# Altium schematic sheet COOLING_FAN.SchDoc
size OrCAD B; SheetNumber: 9; SheetTotal: 12
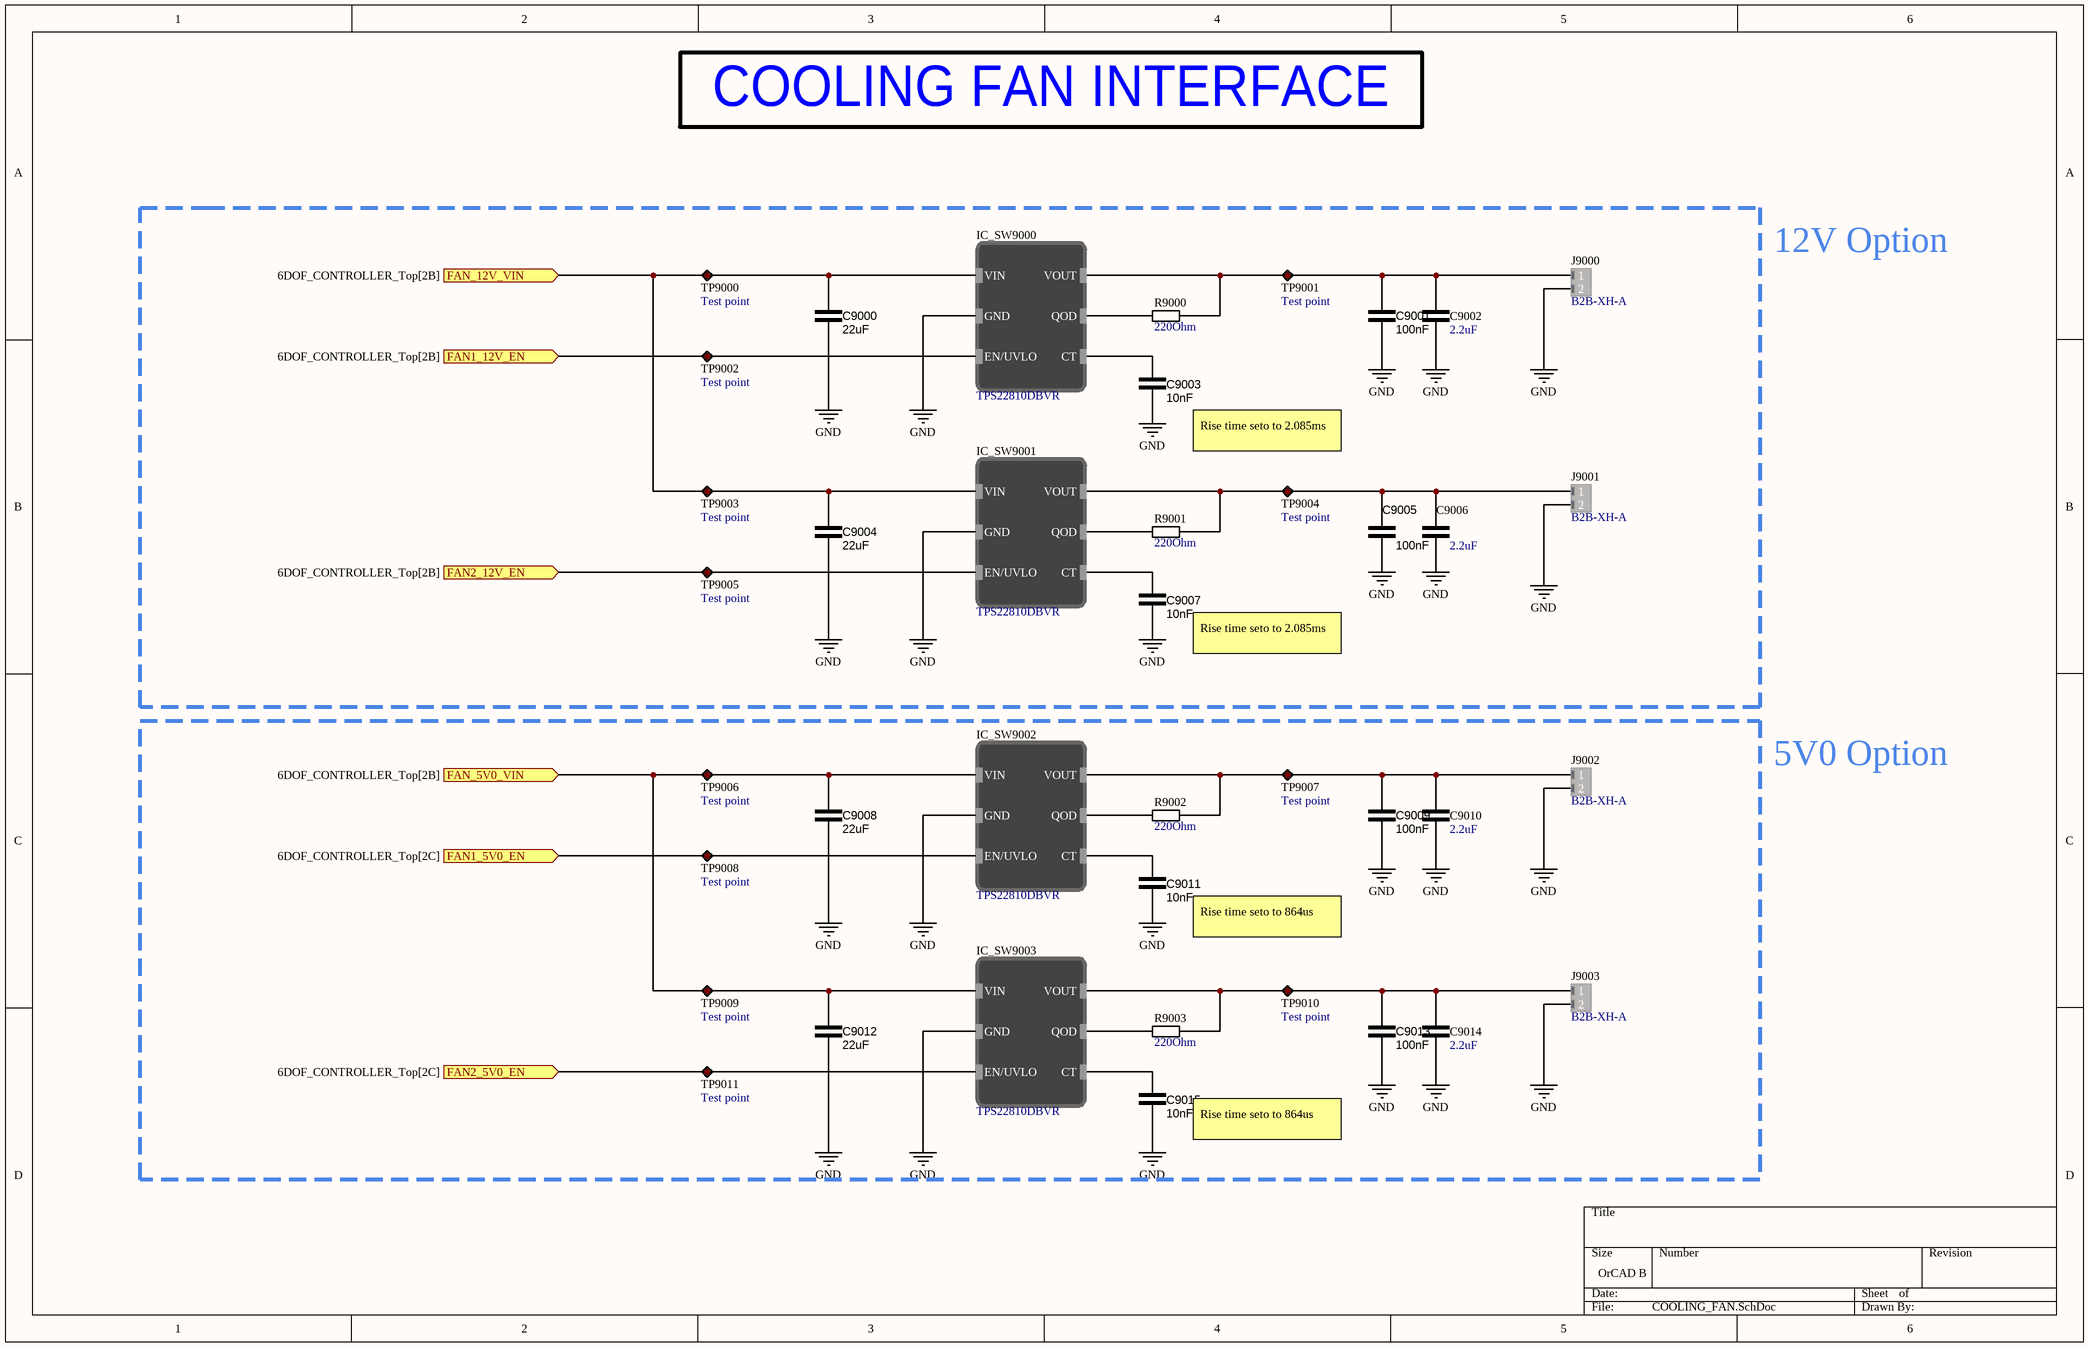
[diagram p0: COOLING_FAN.SchDoc]

## Parts
C9000  22uF  [CAP_0805]
C9001  100nF  [CAP_0603]
C9002  2.2uF  [CAP_0603]
C9003  10nF  [CAP_0603]
C9004  22uF  [CAP_0805]
C9005  100nF  [CAP_0603]
C9006  2.2uF  [CAP_0603]
C9007  10nF  [CAP_0603]
C9008  22uF  [CAP_0805]
C9009  100nF  [CAP_0603]
C9010  2.2uF  [CAP_0603]
C9011  10nF  [CAP_0603]
C9012  22uF  [CAP_0805]
C9013  100nF  [CAP_0603]
C9014  2.2uF  [CAP_0603]
C9015  10nF  [CAP_0603]
IC_SW9000  TPS22810DBVR  [SOT95P280X145-6N]
IC_SW9001  TPS22810DBVR  [SOT95P280X145-6N]
IC_SW9002  TPS22810DBVR  [SOT95P280X145-6N]
IC_SW9003  TPS22810DBVR  [SOT95P280X145-6N]
J9000  B2B-XH-A  [JST_XH_2POS]
J9001  B2B-XH-A  [JST_XH_2POS]
J9002  B2B-XH-A  [JST_XH_2POS]
J9003  B2B-XH-A  [JST_XH_2POS]
R9000  220Ohm  [RES_0603]
R9001  220Ohm  [RES_0603]
R9002  220Ohm  [RES_0603]
R9003  220Ohm  [RES_0603]
TP9000  Test point  [TestPoint]
TP9001  Test point  [TestPoint]
TP9002  Test point  [TestPoint]
TP9003  Test point  [TestPoint]
TP9004  Test point  [TestPoint]
TP9005  Test point  [TestPoint]
TP9006  Test point  [TestPoint]
TP9007  Test point  [TestPoint]
TP9008  Test point  [TestPoint]
TP9009  Test point  [TestPoint]
TP9010  Test point  [TestPoint]
TP9011  Test point  [TestPoint]

## Ports
FAN1_5V0_EN (in, see 6DOF_CONTROLLER_Top[2C]), FAN1_12V_EN (in, see 6DOF_CONTROLLER_Top[2B]), FAN2_5V0_EN (in, see 6DOF_CONTROLLER_Top[2C]), FAN2_12V_EN (in, see 6DOF_CONTROLLER_Top[2B]), FAN_5V0_VIN (in, see 6DOF_CONTROLLER_Top[2B]), FAN_12V_VIN (in, see 6DOF_CONTROLLER_Top[2B])

## Nets
GND: C9000.1 C9001.2 C9002.1 C9003.1 C9004.1 C9005.2 C9006.1 C9007.1 C9008.1 C9009.2 C9010.1 C9011.1 C9012.1 C9013.2 C9014.1 C9015.1 IC_SW9000.2(GND) IC_SW9001.2(GND) IC_SW9002.2(GND) IC_SW9003.2(GND) J9000.2 J9001.2 J9002.2 J9003.2
FAN1_5V0_EN: IC_SW9002.3(EN/UVLO) TP9008.1 ; port FAN1_5V0_EN
FAN1_12V_EN: IC_SW9000.3(EN/UVLO) TP9002.1 ; port FAN1_12V_EN
FAN2_5V0_EN: IC_SW9003.3(EN/UVLO) TP9011.1 ; port FAN2_5V0_EN
FAN2_12V_EN: IC_SW9001.3(EN/UVLO) TP9005.1 ; port FAN2_12V_EN
FAN_5V0_VIN: C9008.2 C9012.2 IC_SW9002.1(VIN) IC_SW9003.1(VIN) TP9006.1 TP9009.1 ; port FAN_5V0_VIN
FAN_12V_VIN: C9000.2 C9004.2 IC_SW9000.1(VIN) IC_SW9001.1(VIN) TP9000.1 TP9003.1 ; port FAN_12V_VIN
NetC9001_1: C9001.1 C9002.2 IC_SW9000.6(VOUT) J9000.1 R9000.2 TP9001.1
NetC9003_2: C9003.2 IC_SW9000.4(CT)
NetC9005_1: C9005.1 C9006.2 IC_SW9001.6(VOUT) J9001.1 R9001.2 TP9004.1
NetC9007_2: C9007.2 IC_SW9001.4(CT)
NetC9009_1: C9009.1 C9010.2 IC_SW9002.6(VOUT) J9002.1 R9002.2 TP9007.1
NetC9011_2: C9011.2 IC_SW9002.4(CT)
NetC9013_1: C9013.1 C9014.2 IC_SW9003.6(VOUT) J9003.1 R9003.2 TP9010.1
NetC9015_2: C9015.2 IC_SW9003.4(CT)
NetIC_SW9000_5: IC_SW9000.5(QOD) R9000.1
NetIC_SW9001_5: IC_SW9001.5(QOD) R9001.1
NetIC_SW9002_5: IC_SW9002.5(QOD) R9002.1
NetIC_SW9003_5: IC_SW9003.5(QOD) R9003.1

## Notes on the sheet
- COOLING FAN INTERFACE
- 12V Option
- Rise time seto to 2.085ms
- (near C9007) Rise time seto to 2.085ms
- 5V0 Option
- Rise time seto to 864us
- (near C9015) Rise time seto to 864us

## Library data of the parts
C9000 C9004 C9008 C9012 = C000001: 22 µF ±20% 25V Ceramic Capacitor X5R 0805 (2012 Metric); ComponentLink1Description: DigiKey; ComponentLink1URL: https://www.digikey.com/en/products/detail/tdk-corporation/C2012X5R1E226M125AC/3661564; DigiKey Part Number: 445-9112-1-ND; capacitance: 22uF
C9001 C9005 C9009 C9013 = C000007: 0.1 µF ±10% 25V Ceramic Capacitor X7R 0603 (1608 Metric); ComponentLink1Description: DigiKey; ComponentLink1URL: https://www.digikey.com/en/products/detail/kyocera-avx/06033C104K4T2A/8019250; DigiKey Part Number: 478-KAM15AR71E104KTCT-ND; capacitance: 100nF
C9002 C9006 C9010 C9014 = C000014: 8 pF ±0.05pF 25V Ceramic Capacitor C0G, NP0 01005 (0402 Metric); ComponentLink1Description: DigiKey; ComponentLink1URL: https://www.digikey.com/en/products/detail/murata-electronics/GRM188C71C225KE11D/4905311; DigiKey Part Number: 490-12731-1-ND; capacitance: 2.2uF
C9003 C9007 C9011 C9015 = C000005: 10000 pF ±20% 25V Ceramic Capacitor X7R 0603 (1608 Metric); ComponentLink1Description: DigiKey; ComponentLink1URL: https://www.digikey.com/en/products/detail/kyocera-avx/06033C103MAT2A/1599370; DigiKey Part Number: 478-KGM15AR71E103MTCT-ND; capacitance: 10nF
IC_SW9000-IC_SW9003 = TPS22810: Power Switch/Driver 1:1 N-Channel 2A SOT-23-6; DigiKey Part Number: 296-45297-1-ND; Mouser Part Number: 595-TPS22810DBVR; ComponentLink1Description: DigiKey; ComponentLink1URL: https://www.digikey.com/en/products/detail/texas-instruments/TPS22810DBVR/6595640; ComponentLink2Description: Mouser; ComponentLink2URL: https://eu.mouser.com/ProductDetail/Texas-Instruments/TPS22810DBVR?qs=34RfhUjJmKcFqeJVMZZhPA%3D%3D
J9000-J9003 = 00000013: Connector Header Through Hole 2 position 0.098" (2.50mm); DigiKey Part Number: 455-B2B-XH-A-ND; ComponentLink1Description: DigiKey; ComponentLink1URL: https://www.digikey.com/en/products/detail/jst-sales-america-inc/B2B-XH-A/1651045
R9000-R9003 = R000021: 220 Ohms ±5% 0.1W, 1/10W Chip Resistor 0603 (1608 Metric) Automotive AEC-Q200 Thick Film; ComponentLink1Description: DigiKey; ComponentLink1URL: https://www.digikey.com/en/products/detail/panasonic-electronic-components/ERJ-3GEYJ221V/135719; resistance: 220Ohm; DigiKey Part Number: P220GCT-ND
TP9000-TP9011 = TP002: Test point 1mm